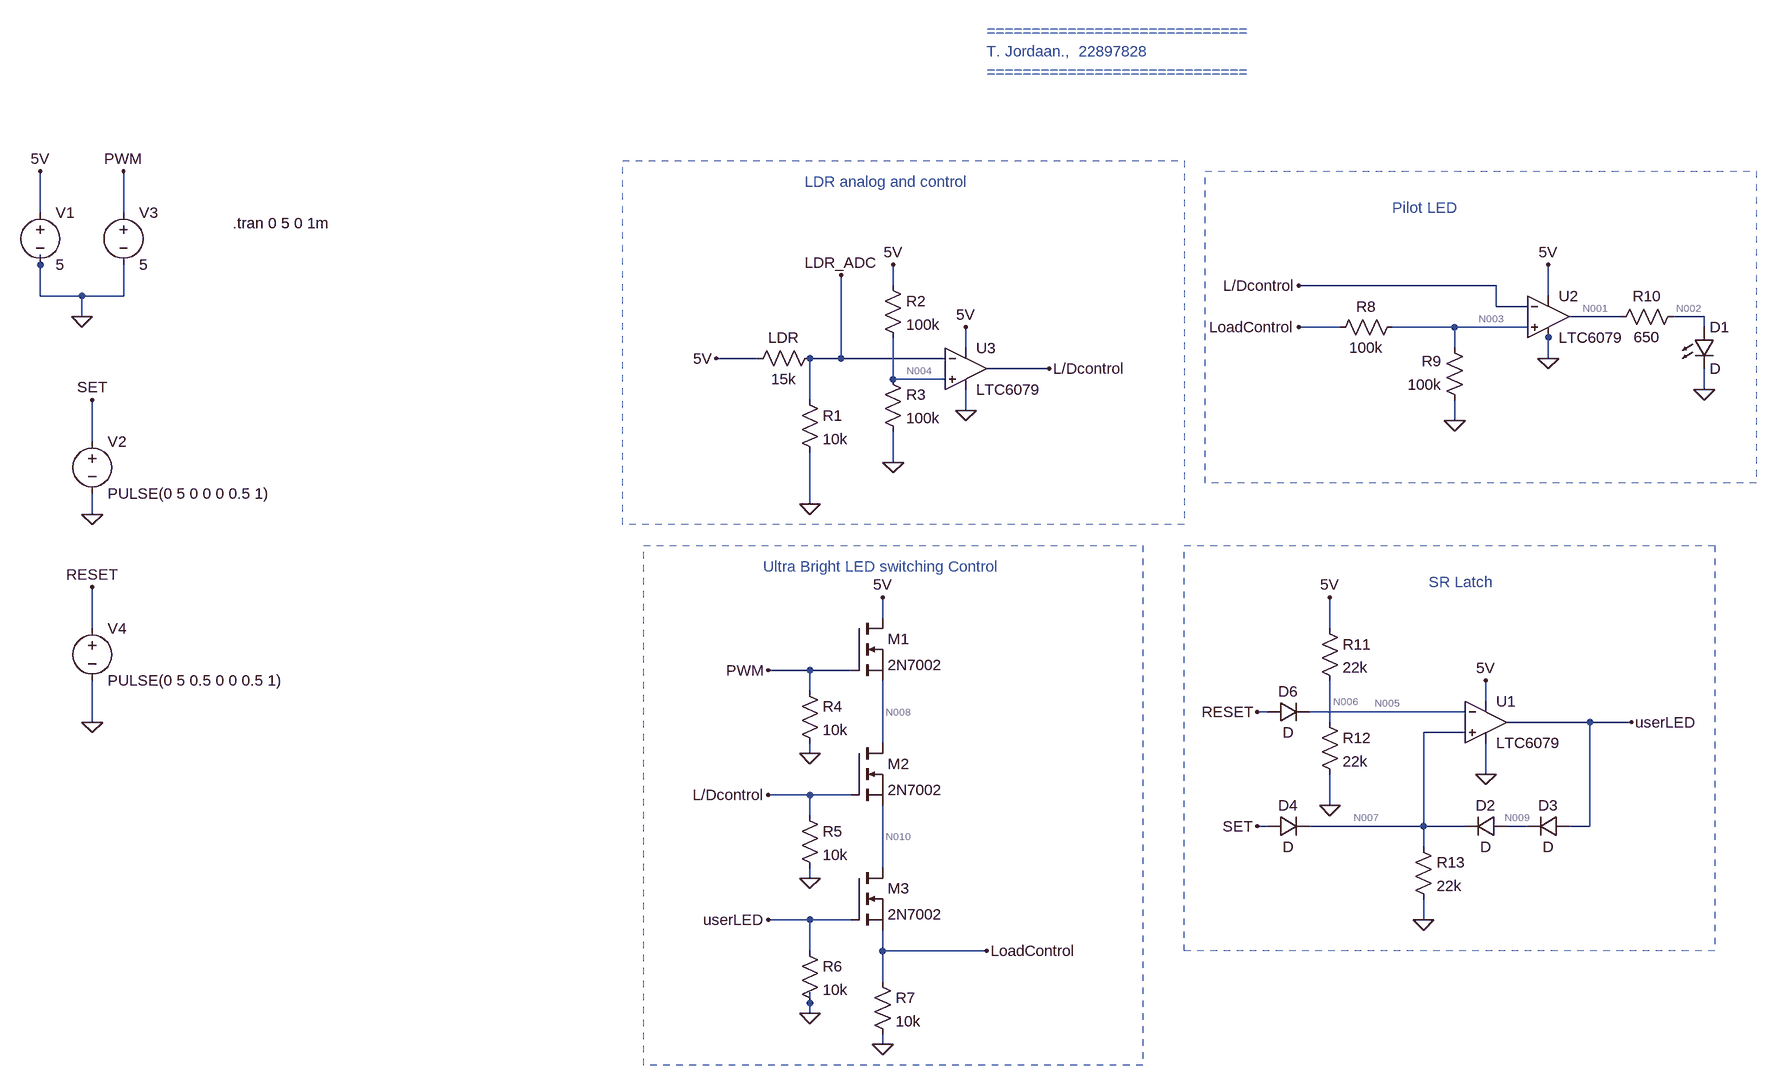
[diagram p0: schematic E344_22897828_A7.asc]
E344_22897828_A7.asc, the LTspice schematic file:
Version 4
SHEET 1 1824 680
WIRE -3008 -1120 -3008 -1184
WIRE -2880 -1120 -2880 -1184
WIRE -3008 -1040 -3008 -1056
WIRE -1696 -1008 -1696 -1040
WIRE -768 -1008 -1072 -1008
WIRE -3008 -992 -3008 -1040
WIRE -2944 -992 -3008 -992
WIRE -2880 -992 -2880 -1040
WIRE -2880 -992 -2944 -992
WIRE -688 -992 -688 -1040
WIRE -768 -976 -768 -1008
WIRE -720 -976 -768 -976
WIRE -2944 -960 -2944 -992
WIRE -576 -960 -656 -960
WIRE -448 -960 -496 -960
WIRE -1008 -944 -1072 -944
WIRE -832 -944 -928 -944
WIRE -720 -944 -832 -944
WIRE -448 -944 -448 -960
WIRE -688 -928 -688 -944
WIRE -1584 -912 -1584 -944
WIRE -832 -912 -832 -944
WIRE -1904 -896 -1968 -896
WIRE -1776 -896 -1776 -1024
WIRE -1776 -896 -1824 -896
WIRE -1616 -896 -1776 -896
WIRE -688 -896 -688 -928
WIRE -1456 -880 -1552 -880
WIRE -1696 -864 -1696 -928
WIRE -1616 -864 -1696 -864
WIRE -448 -848 -448 -880
WIRE -1824 -832 -1824 -896
WIRE -1584 -816 -1584 -848
WIRE -832 -800 -832 -832
WIRE -2928 -768 -2928 -832
WIRE -1696 -736 -1696 -784
WIRE -1824 -672 -1824 -752
WIRE -2928 -656 -2928 -688
WIRE -1712 -496 -1712 -528
WIRE -2928 -480 -2928 -544
WIRE -1024 -480 -1024 -528
WIRE -1824 -416 -1888 -416
WIRE -1760 -416 -1824 -416
WIRE -1824 -384 -1824 -416
WIRE -784 -368 -784 -400
WIRE -1120 -352 -1136 -352
WIRE -816 -352 -1056 -352
WIRE -2928 -336 -2928 -400
WIRE -1024 -336 -1024 -400
WIRE -624 -336 -752 -336
WIRE -560 -336 -624 -336
WIRE -816 -320 -880 -320
WIRE -1712 -304 -1712 -400
WIRE -1824 -288 -1824 -304
WIRE -784 -256 -784 -304
WIRE -1824 -224 -1888 -224
WIRE -1760 -224 -1824 -224
WIRE -1024 -208 -1024 -256
WIRE -1824 -192 -1824 -224
WIRE -1120 -176 -1136 -176
WIRE -880 -176 -880 -320
WIRE -880 -176 -1056 -176
WIRE -816 -176 -880 -176
WIRE -720 -176 -752 -176
WIRE -624 -176 -624 -336
WIRE -624 -176 -656 -176
WIRE -880 -144 -880 -176
WIRE -1712 -112 -1712 -208
WIRE -1824 -96 -1824 -112
WIRE -1824 -32 -1888 -32
WIRE -1760 -32 -1824 -32
WIRE -880 -32 -880 -64
WIRE -1824 16 -1824 -32
WIRE -1712 16 -1712 -16
WIRE -1552 16 -1712 16
WIRE -1712 64 -1712 16
WIRE -1824 96 -1824 80
WIRE -1824 112 -1824 96
WIRE -1712 160 -1712 144
FLAG -3008 -1184 5V
FLAG -1968 -896 5V
FLAG -1824 -672 0
FLAG -1696 -736 0
FLAG -1584 -816 0
FLAG -1584 -944 5V
FLAG -1696 -1040 5V
FLAG -688 -1040 5V
FLAG -1712 -528 5V
FLAG -1024 -528 5V
FLAG -784 -400 5V
FLAG -1776 -1024 LDR_ADC
FLAG -1456 -880 L/Dcontrol
FLAG -1712 160 0
FLAG -1824 112 0
FLAG -1824 -96 0
FLAG -1824 -288 0
FLAG -1888 -416 PWM
FLAG -1888 -224 L/Dcontrol
FLAG -1888 -32 userLED
FLAG -1552 16 LoadControl
FLAG -832 -800 0
FLAG -688 -896 0
FLAG -1072 -1008 L/Dcontrol
FLAG -1072 -944 LoadControl
FLAG -448 -848 0
FLAG -784 -256 0
FLAG -880 -32 0
FLAG -1024 -208 0
FLAG -1136 -176 SET
FLAG -1136 -352 RESET
FLAG -560 -336 userLED
FLAG -2880 -1184 PWM
FLAG -2928 -832 SET
FLAG -2928 -544 RESET
FLAG -2928 -656 0
FLAG -2928 -336 0
FLAG -2944 -960 0
SYMBOL OpAmps\\LTC6079 -784 -336 R0
SYMATTR InstName U1
SYMBOL OpAmps\\LTC6079 -688 -960 R0
SYMATTR InstName U2
SYMBOL OpAmps\\LTC6079 -1584 -880 R0
SYMATTR InstName U3
SYMBOL res -1808 -912 R90
WINDOW 0 0 56 VBottom 2
WINDOW 3 32 56 VTop 2
SYMATTR InstName LDR
SYMATTR Value 15k
SYMBOL res -1840 -848 R0
SYMATTR InstName R1
SYMATTR Value 10k
SYMBOL voltage -3008 -1136 R0
WINDOW 123 0 0 Left 0
WINDOW 39 0 0 Left 0
SYMATTR InstName V1
SYMATTR Value 5
SYMBOL voltage -2928 -784 R0
WINDOW 123 0 0 Left 0
WINDOW 39 0 0 Left 0
SYMATTR InstName V2
SYMATTR Value PULSE(0 5 0 0 0 0.5 1)
SYMBOL res -1712 -1024 R0
SYMATTR InstName R2
SYMATTR Value 100k
SYMBOL res -1712 -880 R0
SYMATTR InstName R3
SYMATTR Value 100k
SYMBOL nmos -1760 -496 R0
SYMATTR InstName M1
SYMATTR Value 2N7002
SYMBOL nmos -1760 -304 R0
SYMATTR InstName M2
SYMATTR Value 2N7002
SYMBOL nmos -1760 -112 R0
SYMATTR InstName M3
SYMATTR Value 2N7002
SYMBOL res -1840 -400 R0
SYMATTR InstName R4
SYMATTR Value 10k
SYMBOL res -1840 -208 R0
SYMATTR InstName R5
SYMATTR Value 10k
SYMBOL res -1840 0 R0
SYMATTR InstName R6
SYMATTR Value 10k
SYMBOL res -1728 48 R0
SYMATTR InstName R7
SYMATTR Value 10k
SYMBOL res -912 -960 R90
WINDOW 0 0 56 VBottom 2
WINDOW 3 32 56 VTop 2
SYMATTR InstName R8
SYMATTR Value 100k
SYMBOL res -816 -816 R180
WINDOW 0 36 76 Left 2
WINDOW 3 36 40 Left 2
SYMATTR InstName R9
SYMATTR Value 100k
SYMBOL res -480 -976 R90
WINDOW 0 0 56 VBottom 2
WINDOW 3 32 56 VTop 2
SYMATTR InstName R10
SYMATTR Value 650
SYMBOL LED -464 -944 R0
SYMATTR InstName D1
SYMBOL res -1040 -496 R0
SYMATTR InstName R11
SYMATTR Value 22k
SYMBOL res -1040 -352 R0
SYMATTR InstName R12
SYMATTR Value 22k
SYMBOL res -896 -160 R0
SYMATTR InstName R13
SYMATTR Value 22k
SYMBOL diode -752 -192 R90
WINDOW 0 0 32 VBottom 2
WINDOW 3 32 32 VTop 2
SYMATTR InstName D2
SYMBOL diode -656 -192 R90
WINDOW 0 0 32 VBottom 2
WINDOW 3 32 32 VTop 2
SYMATTR InstName D3
SYMBOL voltage -2880 -1136 R0
WINDOW 123 0 0 Left 0
WINDOW 39 0 0 Left 0
SYMATTR InstName V3
SYMATTR Value 5
SYMBOL voltage -2928 -496 R0
WINDOW 123 0 0 Left 0
WINDOW 39 0 0 Left 0
SYMATTR InstName V4
SYMATTR Value PULSE(0 5 0.5 0 0 0.5 1)
SYMBOL diode -1120 -160 R270
WINDOW 0 32 32 VTop 2
WINDOW 3 0 32 VBottom 2
SYMATTR InstName D4
SYMBOL diode -1120 -336 R270
WINDOW 0 32 32 VTop 2
WINDOW 3 0 32 VBottom 2
SYMATTR InstName D6
TEXT -1552 -1400 Left 2 ;=============================\nT. Jordaan.,  22897828\n=============================
TEXT -2712 -1104 Left 2 !.tran 0 5 0 1m
TEXT -1896 -576 Left 2 ;Ultra Bright LED switching Control
TEXT -1832 -1168 Left 2 ;LDR analog and control
TEXT -928 -1128 Left 2 ;Pilot LED
TEXT -872 -552 Left 2 ;SR Latch
RECTANGLE Normal -1248 -640 -2112 -1200 2
RECTANGLE Normal -1312 192 -2080 -608 2
RECTANGLE Normal -368 -704 -1216 -1184 2
RECTANGLE Normal -432 16 -1248 -608 2

The netlist it stands for:
* E344_22897828_A7.asc
XU1 N007 N005 5V 0 userLED LTC6078  ; LTC6079, pins In+ In- V+ V- OUT
XU2 N003 L/Dcontrol 5V 0 N001 LTC6078  ; LTC6079, pins In+ In- V+ V- OUT
XU3 N004 LDR_ADC 5V 0 L/Dcontrol LTC6078  ; LTC6079, pins In+ In- V+ V- OUT
R§LDR LDR_ADC 5V 15k
R1 LDR_ADC 0 10k
V1 5V 0 5
V2 SET 0 PULSE(0 5 0 0 0 0.5 1)
R2 5V N004 100k
R3 N004 0 100k
M1 5V PWM N008 N008 2N7002
M2 N008 L/Dcontrol N010 N010 2N7002
M3 N010 userLED LoadControl LoadControl 2N7002
R4 PWM 0 10k
R5 L/Dcontrol 0 10k
R6 userLED 0 10k
R7 LoadControl 0 10k
R8 N003 LoadControl 100k
R9 0 N003 100k
R10 N002 N001 650
D1 N002 0 D
R11 5V N006 22k
R12 N006 0 22k
R13 N007 0 22k
D2 N009 N007 D
D3 userLED N009 D
V3 PWM 0 5
V4 RESET 0 PULSE(0 5 0.5 0 0 0.5 1)
D4 SET N007 D
D6 RESET N005 D
.model D D
.lib standard.dio
.model NMOS NMOS
.model PMOS PMOS
.lib standard.mos
* =============================
* T. Jordaan.,  22897828
* =============================
.tran 0 5 0 1m
* Ultra Bright LED switching Control
* LDR analog and control
* Pilot LED
* SR Latch
.lib LTC5.lib
.backanno
.end

* Results of the author's LTspice run, read from the files saved beside the schematic
* Operating Point, zero values left out:
*   V(5v) = 5 V
*   V(n007) = 3.747 V
*   V(n005) = 1.359 V
*   V(userled) = 4.966 V
*   V(n003) = 1.674 V
*   V(l/dcontrol) = 4.974 V
*   V(n001) = 26.49 µV
*   V(n004) = 2.5 V
*   V(ldr_adc) = 2 V
*   V(pwm) = 5 V
*   V(n008) = 3.41 V
*   V(n010) = 3.375 V
*   V(loadcontrol) = 3.348 V
*   V(n002) = 26.49 µV
*   V(n006) = 2.5 V
*   V(n009) = 4.356 V
*   Id(M3) = 351.5 µA
*   Is(M3) = -351.5 µA
*   Id(M2) = 351.5 µA
*   Is(M2) = -351.5 µA
*   Id(M1) = 351.5 µA
*   Is(M1) = -351.5 µA
*   I(D6) = -1.369 pA
*   I(D4) = -3.757 pA
*   I(D3) = 170.3 µA
*   I(D2) = 170.3 µA
*   I(R13) = 170.3 µA
*   I(R12) = 113.6 µA
*   I(R11) = 113.6 µA
*   I(R9) = -16.74 µA
*   I(R8) = -16.74 µA
*   I(R7) = 334.8 µA
*   I(R6) = 496.6 µA
*   I(R5) = 497.4 µA
*   I(R4) = 500 µA
*   I(R3) = 25 µA
*   I(R2) = 25 µA
*   I(R1) = 200 µA
*   I(Ldr) = -200 µA
*   I(V4) = 1.369 pA
*   I(V3) = -500 µA
*   I(V2) = 3.757 pA
*   I(V1) = -1.963 mA
*   Ix(u1:1) = 1.027 pA
*   Ix(u1:2) = -1.369 pA
*   Ix(u1:3) = 702.9 µA
*   Ix(u1:4) = -36.04 µA
*   Ix(u1:5) = -666.9 µA
*   Ix(u2:1) = -1.361 pA
*   Ix(u2:2) = 2.125 pA
*   Ix(u2:3) = 36.04 µA
*   Ix(u2:4) = -36.04 µA
*   Ix(u2:5) = 5 pA
*   Ix(u3:3) = 533.5 µA
*   Ix(u3:4) = -36.04 µA
*   Ix(u3:5) = -497.4 µA
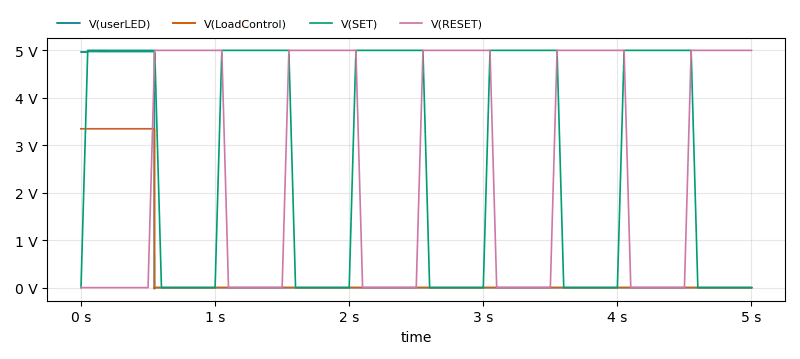
[diagram p1: Transient Analysis of E344_22897828_A7.asc, plotted from the saved traces]
* Transient Analysis, 1 run:
*   V(userLED): min 26.35 µV, max 4.974 V, average 544.3 mV, rms 1.645 V, last 26.35 µV
*   V(LoadControl): min -24.91 mV, max 3.35 V, average 366.5 mV, rms 1.108 V, last 0 V
*   V(SET): min 0 V, max 5 V, average 2.75 V, rms 3.659 V, last 0 V
*   V(RESET): min 0 V, max 5 V, average 2.675 V, rms 3.652 V, last 5 V